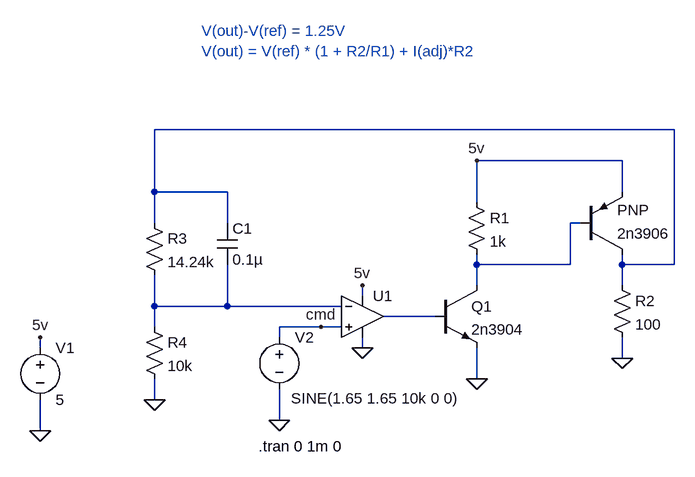
[diagram p0: schematic rail_output_sim.asc]
rail_output_sim.asc, the LTspice schematic file:
Version 4
SHEET 1 880 1124
WIRE 608 -96 -192 -96
WIRE 528 -48 304 -48
WIRE -192 0 -192 -96
WIRE -80 0 -192 0
WIRE 528 0 528 -48
WIRE 304 16 304 -48
WIRE -192 48 -192 0
WIRE -80 48 -80 0
WIRE 464 48 448 48
WIRE 304 112 304 96
WIRE 448 112 448 48
WIRE 448 112 304 112
WIRE 528 112 528 96
WIRE 608 112 608 -96
WIRE 608 112 528 112
WIRE 304 144 304 112
WIRE 528 144 528 112
WIRE 128 160 128 144
WIRE -192 176 -192 128
WIRE -80 176 -80 112
WIRE -80 176 -192 176
WIRE 96 176 -80 176
WIRE 240 192 160 192
WIRE -192 208 -192 176
WIRE 64 208 0 208
WIRE 96 208 64 208
WIRE 0 224 0 208
WIRE -368 240 -368 224
WIRE 128 240 128 224
WIRE 528 256 528 224
WIRE 304 288 304 240
WIRE -192 320 -192 288
WIRE 0 352 0 304
WIRE -368 368 -368 320
FLAG -368 368 0
FLAG 0 352 0
FLAG 64 208 cmd
FLAG 128 144 5v
FLAG 128 240 0
FLAG 304 -48 5v
FLAG -368 224 5v
FLAG 304 288 0
FLAG 528 256 0
FLAG -192 320 0
SYMBOL voltage -368 224 R0
SYMATTR InstName V1
SYMATTR Value 5
SYMBOL voltage 0 208 R0
WINDOW 3 18 110 Left 2
WINDOW 123 0 0 Left 0
WINDOW 39 0 0 Left 0
SYMATTR Value SINE(1.65 1.65 10k 0 0)
SYMATTR InstName V2
SYMBOL OpAmps\\UniversalOpAmp2 128 192 R0
SYMATTR InstName U1
SYMBOL npn 240 144 R0
SYMATTR InstName Q1
SYMATTR Value 2n3904
SYMBOL res 288 0 R0
SYMATTR InstName R1
SYMATTR Value 1k
SYMBOL pnp 464 96 M180
SYMATTR InstName 2n3906
SYMBOL res 512 128 R0
SYMATTR InstName R2
SYMATTR Value 100
SYMBOL res -208 32 R0
SYMATTR InstName R3
SYMATTR Value 14.24k
SYMBOL res -208 192 R0
SYMATTR InstName R4
SYMATTR Value 10k
SYMBOL cap -96 48 R0
SYMATTR InstName C1
SYMATTR Value 0.1µ
TEXT -32 392 Left 2 !.tran 0 1m 0
TEXT -120 -248 Left 2 ;V(out)-V(ref) = 1.25V\nV(out) = V(ref) * (1 + R2/R1) + I(adj)*R2

The netlist it stands for:
* rail_output_sim.asc
V1 5v 0 5
V2 cmd 0 SINE(1.65 1.65 10k 0 0)
XU1 cmd N003 5v 0 N004 level2 Avol=1Meg GBW=10Meg Slew=10Meg Ilimit=25m Rail=0 Vos=0 En=0 Enk=0 In=0 Ink=0 Rin=500Meg  ; pins In+ In- V+ V- OUT
Q1 N002 N004 0 0 2n3904
R1 5v N002 1k
Q§2n3906 N001 N002 5v 0 PNP
R2 N001 0 100
R3 N001 N003 14.24k
R4 N003 0 10k
C1 N001 N003 0.1µ
.model NPN NPN
.model PNP PNP
.lib standard.bjt
.tran 0 1m 0
* V(out)-V(ref) = 1.25V
* V(out) = V(ref) * (1 + R2/R1) + I(adj)*R2
.lib UniversalOpAmp2.lib
.backanno
.end